# Altium project Fuel Cell Monitor Master.PrjPcb
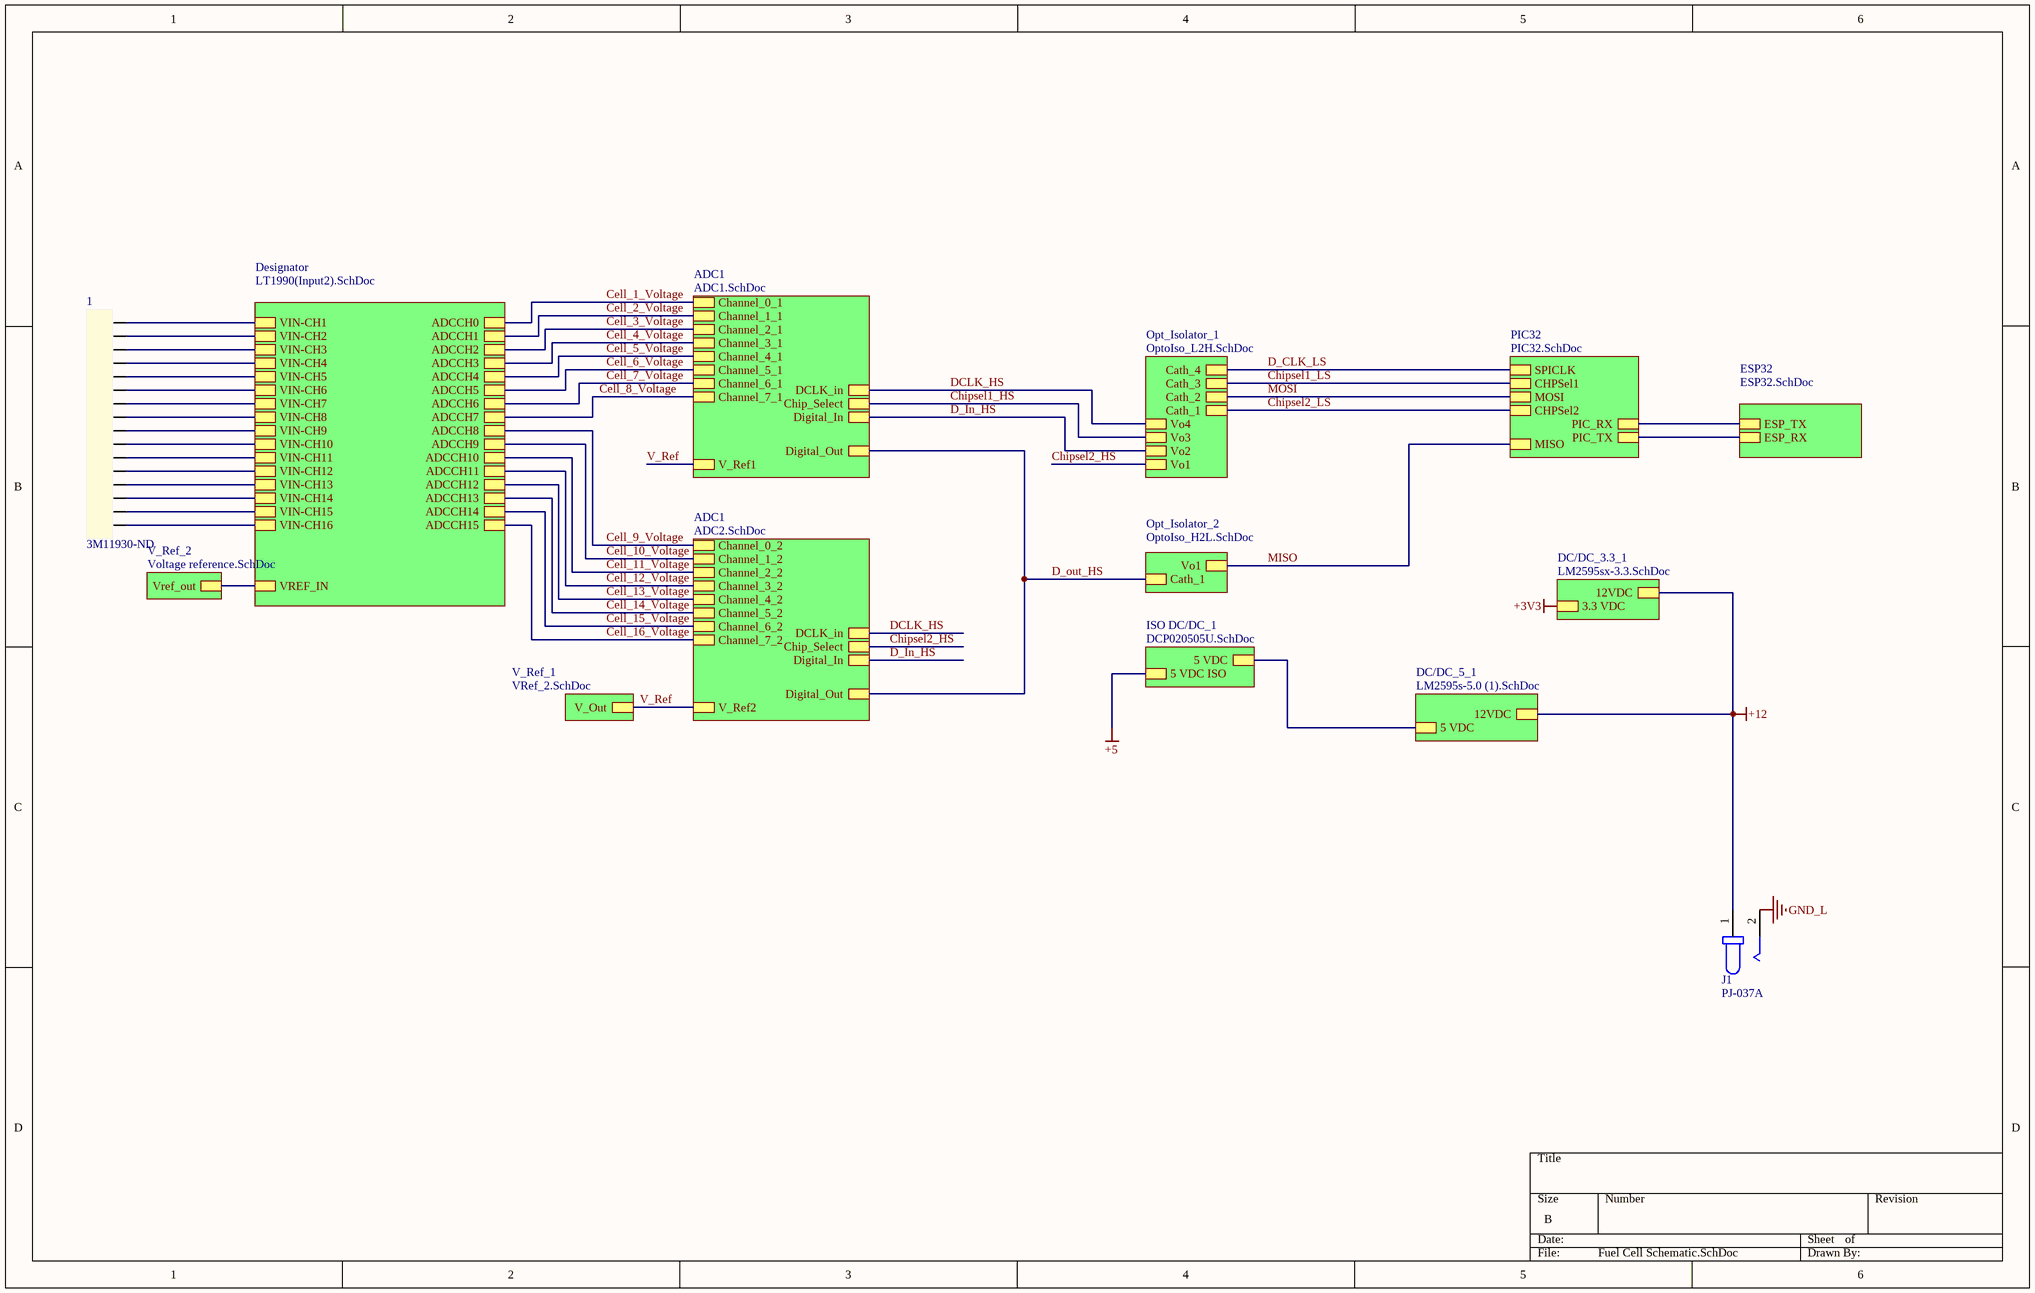
[diagram p0: Fuel Cell Schematic.SchDoc]
4 sheets, 24 parts. Net scope: hierarchical (ports join the sheet entries above them; power ports are global).
Board file: FCM_Integrated.PcbDoc
Sheets:
  Fuel Cell Schematic.SchDoc
    Opt_Isolator_1 = OptoIso_L2H.SchDoc
    ADC1 = ADC2.SchDoc
    PIC32 = PIC32.SchDoc

## Sheet Fuel Cell Schematic.SchDoc
size B; SheetNumber: 1; SheetTotal: 13

### Parts
1  Supplier Part Number 1: 3M11930-ND  [IDC Connector_16POS_2Layer]
J1  PJ-037A  [CUI_PJ-037A]

### Sub-sheets
ADC1 = ADC1.SchDoc (file not in this document): DCLK_in, Chip_Select, Digital_In, Digital_Out, Channel_0_1, Channel_1_1, Channel_2_1, Channel_3_1, Channel_4_1, Channel_5_1, Channel_6_1, Channel_7_1, V_Ref1
ADC1 = ADC2.SchDoc: DCLK_in, Chip_Select, Digital_In, Digital_Out, Channel_0_2, Channel_1_2, Channel_2_2, Channel_3_2, Channel_4_2, Channel_5_2, Channel_6_2, Channel_7_2, V_Ref2
DC/DC_3.3_1 = LM2595sx-3.3.SchDoc (file not in this document): 12VDC, 3.3 VDC
DC/DC_5_1 = LM2595s-5.0 (1).SchDoc (file not in this document): 12VDC, 5 VDC
Designator = LT1990(Input2).SchDoc (file not in this document): ADCCH1, ADCCH2, ADCCH3, VIN-CH3, ADCCH4, VIN-CH4, VIN-CH5, ADCCH5, VIN-CH6, ADCCH6, ADCCH7, ADCCH8, VIN-CH8, ADCCH9, VIN-CH9, ADCCH10, VIN-CH10, ADCCH11, VIN-CH11, ADCCH12, VIN-CH12, ADCCH13, VIN-CH13, ADCCH14, VIN-CH14, ADCCH15, VIN-CH15, VIN-CH16, VIN-CH2, ADCCH0, VIN-CH1, VREF_IN, VIN-CH7
ESP32 = ESP32.SchDoc (file not in this document): ESP_TX, ESP_RX
ISO DC/DC_1 = DCP020505U.SchDoc (file not in this document): 5 VDC, 5 VDC ISO
Opt_Isolator_1 = OptoIso_L2H.SchDoc: Vo4, Vo3, Vo2, Cath_4, Cath_3, Cath_2, Cath_1, Vo1
Opt_Isolator_2 = OptoIso_H2L.SchDoc (file not in this document): Cath_1, Vo1
PIC32 = PIC32.SchDoc: CHPSel2, MOSI, CHPSel1, PIC_TX, PIC_RX, MISO, SPICLK
V_Ref_1 = VRef_2.SchDoc (file not in this document): V_Out
V_Ref_2 = Voltage reference.SchDoc (file not in this document): Vref_out

### Nets
+12: J1.1 ; sheet DC/DC_3.3_1/12VDC, sheet DC/DC_5_1/12VDC
GND_L: J1.2
Cell_1_Voltage: sheet ADC1/Channel_0_1, sheet Designator/ADCCH0
Cell_2_Voltage: sheet ADC1/Channel_1_1, sheet Designator/ADCCH1
Cell_3_Voltage: sheet ADC1/Channel_2_1, sheet Designator/ADCCH2
Cell_4_Voltage: sheet ADC1/Channel_3_1, sheet Designator/ADCCH3
Cell_5_Voltage: sheet ADC1/Channel_4_1, sheet Designator/ADCCH4
Cell_6_Voltage: sheet ADC1/Channel_5_1, sheet Designator/ADCCH5
Cell_7_Voltage: sheet ADC1/Channel_6_1, sheet Designator/ADCCH6
Cell_8_Voltage: sheet ADC1/Channel_7_1, sheet Designator/ADCCH7
Cell_9_Voltage: sheet ADC1/Channel_0_2, sheet Designator/ADCCH8
Cell_10_Voltage: sheet ADC1/Channel_1_2, sheet Designator/ADCCH9
Cell_11_Voltage: sheet ADC1/Channel_2_2, sheet Designator/ADCCH10
Cell_12_Voltage: sheet ADC1/Channel_3_2, sheet Designator/ADCCH11
Cell_13_Voltage: sheet ADC1/Channel_4_2, sheet Designator/ADCCH12
Cell_14_Voltage: sheet ADC1/Channel_5_2, sheet Designator/ADCCH13
Cell_15_Voltage: sheet ADC1/Channel_6_2, sheet Designator/ADCCH14
Cell_16_Voltage: sheet ADC1/Channel_7_2, sheet Designator/ADCCH15
Chipsel1_HS: sheet ADC1/Chip_Select, sheet Opt_Isolator_1/Vo3
Chipsel1_LS: sheet Opt_Isolator_1/Cath_3, sheet PIC32/CHPSel1
Chipsel2_HS: sheet Opt_Isolator_1/Vo1, sheet ADC1/Chip_Select
Chipsel2_LS: sheet Opt_Isolator_1/Cath_1, sheet PIC32/CHPSel2
D_CLK_LS: sheet Opt_Isolator_1/Cath_4, sheet PIC32/SPICLK
D_In_HS: sheet ADC1/Digital_In, sheet Opt_Isolator_1/Vo2, sheet ADC1/Digital_In
D_out_HS: sheet ADC1/Digital_Out, sheet Opt_Isolator_2/Cath_1, sheet ADC1/Digital_Out
DCLK_HS: sheet ADC1/DCLK_in, sheet Opt_Isolator_1/Vo4, sheet ADC1/DCLK_in
ESPout-PICin: sheet ESP32/ESP_TX, sheet PIC32/PIC_RX
MISO: sheet Opt_Isolator_2/Vo1, sheet PIC32/MISO
MOSI: sheet Opt_Isolator_1/Cath_2, sheet PIC32/MOSI  [project net D_in_LS]
PICout-ESPin: sheet ESP32/ESP_RX, sheet PIC32/PIC_TX
V_Ref: sheet ADC1/V_Ref1, sheet ADC1/V_Ref2, sheet V_Ref_1/V_Out
Net1_1: 1.1 ; sheet Designator/VIN-CH1
Net1_2: 1.2 ; sheet Designator/VIN-CH2
Net1_3: 1.3 ; sheet Designator/VIN-CH3
Net1_4: 1.4 ; sheet Designator/VIN-CH4
Net1_5: 1.5 ; sheet Designator/VIN-CH5
Net1_6: 1.6 ; sheet Designator/VIN-CH6
Net1_7: 1.7 ; sheet Designator/VIN-CH7
Net1_8: 1.8 ; sheet Designator/VIN-CH8
Net1_9: 1.9 ; sheet Designator/VIN-CH9
Net1_10: 1.10 ; sheet Designator/VIN-CH10
Net1_11: 1.11 ; sheet Designator/VIN-CH11
Net1_12: 1.12 ; sheet Designator/VIN-CH12
Net1_13: 1.13 ; sheet Designator/VIN-CH13
Net1_14: 1.14 ; sheet Designator/VIN-CH14
Net1_15: 1.15 ; sheet Designator/VIN-CH15
Net1_16: 1.16 ; sheet Designator/VIN-CH16
(unnamed): sheet Designator/VREF_IN, sheet V_Ref_2/Vref_out
(unnamed): sheet ISO DC/DC_1/5 VDC, sheet DC/DC_5_1/5 VDC

### Library data of the parts
1 = 30316-5002HB: Conn Shrouded Header (4 Sides) HDR 16 POS 2.54mm Solder RA Side Entry Thru-Hole Box; Manufacturer: 3M; Gender: Male; Current Rating: 1A; Number of Positions: 16; Connector Type: Male Pin; Row Spacing: 0.1inch; Supplier 1: Digi-Key; Manufacturer Part Number: 30316-5002HB; RoHS: Yes; Category: Connectors; Stock 1: 5922; Pricing 1: 1=1.55000, 10=1.35200, 100=1.20850, 500=1.00712, 1000=0.86325, 5000=0.76541, 10000=0.74815 (USD); Mounting Technology: Through Hole; Contact Plating: Gold; Contact Material: Brass; Color: Black; Housing Material: Polyester; Housing Color: Black; Min Operating Temperature: -55°C; Max Operating Temperature: 105°C; Number of Rows: 2; Termination: Solder; Package Quantity: 1000; Packaging: Bulk; Series: 303; Contact Type: Male Pin; Orientation: Right Angle; Max Current Rating: 1A; Length: 27.9mm; Pitch: 2.54mm; Contact Mating Length: 0.236inch; Depth: 13.26mm; Lead Free: Lead Free; RoHS Compliant: Yes; ComponentLink1URL: https://datasheet.ciiva.com/6832/ts0818-6832733.pdf?src-supplier=Digi-Key; ComponentLink1Description: https://datasheet.ciiva.com/6832/ts0818-6832733.pdf?src-supplier=Digi-Key
J1 = PJ-037A: 2.0 mm Center Pin, 2.5 A, Right Angle, Through Hole, Dc Power Jack Connector; Value: *; Price: None; MP: PJ-037A; Availability: Unavailable; Package: None

## Sheet OptoIso_L2H.SchDoc
size A; SheetNumber: 7; SheetTotal: 11
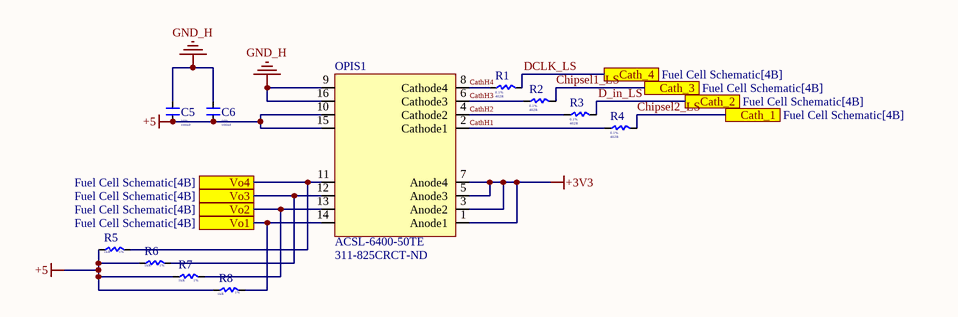
[diagram p1: OptoIso_L2H.SchDoc]

### Parts
C5  Tolerance: 10%  Capacitance: 100nF  [Capacitor_Kemet_0805]
C6  Tolerance: 10%  Capacitance: 100nF  [Capacitor_Kemet_0805]
OPIS1  Supplier Part Number 2: 311-825CRCT-ND  [Opto_Isolator_ACSL6400_50TE]
R1  Tolerance: 0.1%  Resistance: 402R  [LowR_Yageo]
R2  Tolerance: 0.1%  Resistance: 402R  [LowR_Yageo]
R3  Tolerance: 0.1%  Resistance: 402R  [LowR_Yageo]
R4  Tolerance: 0.1%  Resistance: 402R  [LowR_Yageo]
R5  Resistance: 1kR  Tolerance: 1%  [Resistor_YAGEO_0805]
R6  Resistance: 1kR  Tolerance: 1%  [Resistor_YAGEO_0805]
R7  Resistance: 1kR  Tolerance: 1%  [Resistor_YAGEO_0805]
R8  Resistance: 1kR  Tolerance: 1%  [Resistor_YAGEO_0805]

### Ports
Cath_1 (see Fuel Cell Schematic[4B]), Cath_2 (see Fuel Cell Schematic[4B]), Cath_3 (see Fuel Cell Schematic[4B]), Cath_4 (see Fuel Cell Schematic[4B]), Vo1 (see Fuel Cell Schematic[4B]), Vo2 (see Fuel Cell Schematic[4B]), Vo3 (see Fuel Cell Schematic[4B]), Vo4 (see Fuel Cell Schematic[4B])

### Nets
+3V3: OPIS1.1(Anode1) OPIS1.3(Anode2) OPIS1.5(Anode3) OPIS1.7(Anode4)
+5: C5.2 C6.2 OPIS1.10(VDD) OPIS1.15(VDD) R5.1 R6.1 R7.1 R8.1
GND_H: C5.1 C6.1 OPIS1.9(Ground) OPIS1.16(Ground)
CathH1: OPIS1.2(Cathode1) R4.1
CathH2: OPIS1.4(Cathode2) R3.1
CathH3: OPIS1.6(Cathode3) R2.1
CathH4: OPIS1.8(Cathode4) R1.1
Chipsel1_HS: OPIS1.12(Vo3) R6.2 ; port Vo3
Chipsel1_LS: R2.2 ; port Cath_3
Chipsel2_HS: OPIS1.14(Vo1) R8.2 ; port Vo1
Chipsel2_LS: R4.2 ; port Cath_1
D_In_HS: OPIS1.13(Vo2) R7.2 ; port Vo2
D_in_LS: R3.2 ; port Cath_2
DCLK_HS: OPIS1.11(Vo4) R5.2 ; port Vo4
DCLK_LS: R1.2 ; port Cath_4  [project net D_CLK_LS]

### Library data of the parts
C5 C6 = C0805C104K6RACTU: Cap Ceramic 0.1uF 35V X7R 10% SMD 0805 125°C Paper T/R; Manufacturer: KEMET; Supplier 1: Digi-Key; Manufacturer Part Number: C0805C104K6RACTU; RoHS: Yes; Category: Ceramic Capacitors; Stock 1: 14662; Pricing 1: 1=0.44000, 10=0.30300, 50=0.21200, 100=0.18180, 500=0.13636, 1000=0.11514 (USD); Mount: Surface Mount; Case/Package: 0805; Dielectric Material: Ceramic; Min Operating Temperature: -55°C; Max Operating Temperature: 125°C; Packaging: Tape and Reel; Dielectric: X7R; Voltage Rating (DC): 35V; Construction: Flat; Length: 2mm; Height: 0.9mm; Depth: 1.25mm; Radiation Hardening: No; RoHS Compliant: Yes; ComponentLink1URL: http://www.kemet.com/kemet/web/homepage/kechome.nsf/weben/C4DA2DA1D1C9D3C3CA2570A50016092D/$file/KEM_C1002_X7R_SMD.pdf?src-supplier=Avnet; ComponentLink1Description: http://www.kemet.com/kemet/web/homepage/kechome.nsf/weben/C4DA2DA1D1C9D3C3CA2570A50016092D/$file/KEM_C1002_X7R_SMD.pdf?src-supplier=Avnet; ComponentLink2URL: https://api.kemet.com/component-edge/download/datasheet/C0805C104K6RAC7800.pdf?src-supplier=Digi-Key; ComponentLink2Description: https://api.kemet.com/component-edge/download/datasheet/C0805C104K6RAC7800.pdf?src-supplier=Digi-Key; Supplier Part Number 1: 399-17618-1-ND
OPIS1 = ACSL-6400-50TE: OPTOISO 2.5KV 4CH OPEN COLL 16SO; Manufacturer: Broadcom Avago; Forward Voltage: 1.8V; Forward Current: 15mA; Output Current: 50mA; Propagation Delay: 100ns; Reverse Breakdown Voltage: 5V; Max Power Dissipation: 40mW; Rise Time: 35ns; Number of Channels: 4; Fall Time: 12ns; Power Dissipation: 65mW; Data Rate: 15Mbps; Output Voltage: 7V; Input Type: DC; Supplier 1: Digi-Key; RoHS: Yes; Category: Optocouplers; Stock 1: 12687; Pricing 1: 1=10.50000, 10=7.61700, 100=6.29380, 500=5.51204 (USD); Mount: Surface Mount; Case/Package: SOIC; Number of Pins: 16; Contact Plating: Tin,Matte; Min Operating Temperature: -40°C; Max Operating Temperature: 100°C; Packaging: Tape and Reel; Max Output Current: 50mA; Package Quantity: 1000; Output Current per Channel: 50mA; Number of Elements: 4; Turn-On Delay Time: 100ns; Isolation Voltage: 2.5kV; Input Current: 15mA; Series: -; Radiation Hardening: No; REACH SVHC: No SVHC; Lead Free: Lead Free; RoHS Compliant: Yes; ComponentLink1URL: http://components.arrow.com/part/dataview/41316762S9676761N7786?src-supplier=Arrow+Electronics; ComponentLink1Description: http://components.arrow.com/part/dataview/41316762S9676761N7786?src-supplier=Arrow+Electronics; ComponentLink2URL: http://www.farnell.com/datasheets/1790955.pdf?src-supplier=Farnell; ComponentLink2Description: http://www.farnell.com/datasheets/1790955.pdf?src-supplier=Farnell; ComponentLink3URL: https://www.verical.com/server-webapp/html/getDatasheet?partID=300680&src-supplier=Verical; ComponentLink3Description: https://www.verical.com/server-webapp/html/getDatasheet?partID=300680&src-supplier=Verical; ComponentLink4URL: http://www.avagotech.com/docs/AV02-0235EN?src-supplier=Avnet; ComponentLink4Description: http://www.avagotech.com/docs/AV02-0235EN?src-supplier=Avnet; ComponentLink5URL: http://www.avagotech.com/docs/AV02-0235EN?src-supplier=Digi-Key; ComponentLink5Description: http://www.avagotech.com/docs/AV02-0235EN?src-supplier=Digi-Key; ComponentLink6URL: https://docs.broadcom.com/docs/AV02-0235EN?src-supplier=Digi-Key; ComponentLink6Description: https://docs.broadcom.com/docs/AV02-0235EN?src-supplier=Digi-Key; ComponentLink7URL: http://www.farnell.com/datasheets/1790955.pdf?src-supplier=Newark; ComponentLink7Description: http://www.farnell.com/datasheets/1790955.pdf?src-supplier=Newark; ComponentLink8URL: http://www.farnell.com/datasheets/1790955.pdf?src-supplier=Element14; ComponentLink8Description: http://www.farnell.com/datasheets/1790955.pdf?src-supplier=Element14; ComponentLink9URL: http://www.avagotech.com/search/results.jsp?src=&siteCriteria=ACSL6400&src-supplier=Mouser; ComponentLink9Description: http://www.avagotech.com/search/results.jsp?src=&siteCriteria=ACSL6400&src-supplier=Mouser; Supplier Part Number 1: 516-2917-1-ND; Supplier 2: Digi-Key; Manufacturer Part Number: ACSL-6400-50TE
R1-R4 = RT0805BRD07402RL: Res Thin Film 0805 402 Ohm 0.1% 1/8W ±25ppm/°C Molded SMD Paper T/R; Manufacturer: Yageo; Voltage Rating: 150V; Power Rating: 125mW; Supplier 1: Digi-Key; Manufacturer Part Number: RT0805BRD07402RL; RoHS: Yes; Category: Chip SMD Resistors; Stock 1: 13492; Pricing 1: 1=0.38000, 10=0.27200, 100=0.10870, 1000=0.05357, 2500=0.04963 (USD); Case/Package: 0805; Case Code (Metric): 2012; Case Code (Imperial): 0805; Min Operating Temperature: -55°C; Max Operating Temperature: 125°C; Packaging: Tape and Reel; Termination: SMD/SMT; Temperature Coefficient: 25ppm/°C; Voltage Rating (DC): 150V; Series: RT; Length: 2mm; Width: 1.25mm; Height: 500um; Lead Free: Lead Free; RoHS Compliant: Yes; ComponentLink1URL: https://datasheet.ciiva.com/12706/pyu-rt-1-to-0-05-rohs-l-4-12706505.pdf?src-supplier=Mouser; ComponentLink1Description: https://datasheet.ciiva.com/12706/pyu-rt-1-to-0-05-rohs-l-4-12706505.pdf?src-supplier=Mouser; Supplier Part Number 1: YAG4897CT-ND
R5-R8 = RC0805FR-071KP: Res Thick Film 0805 1K Ohm 1% 0.125W(1/8W) ±100ppm/C Pad SMD T/R; Manufacturer: Yageo; Max Power Dissipation: 125mW; Temperature Coefficient: 100ppm/°C; Supplier 1: Digi-Key; Manufacturer Part Number: RC0805FR-071KP; RoHS: Yes; Category: Chip SMD Resistors; Stock 1: 37560; Pricing 1: 1=0.10000, 10=0.06400, 100=0.02600, 1000=0.01168, 2500=0.01014 (USD); Case/Package: 0805; Case Code (Metric): 2012; Case Code (Imperial): 0805; Min Operating Temperature: -55°C; Max Operating Temperature: 155°C; Packaging: Tape and Reel; Resistor Type: Thick Film; Number of Terminations: 2; Features: Moisture Resistant; Length: 0.079inch; Width: 0.049inch; Height: 0.024inch; RoHS Compliant: Yes; ComponentLink1URL: http://www.yageo.com/NewPortal/yageodocoutput?fileName=/pdf/R-Chip/PYu-RC_51_RoHS_P_0.pdf&src-supplier=Digi-Key; ComponentLink1Description: http://www.yageo.com/NewPortal/yageodocoutput?fileName=/pdf/R-Chip/PYu-RC_51_RoHS_P_0.pdf&src-supplier=Digi-Key; ComponentLink2URL: http://www.yageo.com.tw/exep/pages/download/literatures/PYu-R_INT-thick_7.pdf?src-supplier=Digi-Key; ComponentLink2Description: http://www.yageo.com.tw/exep/pages/download/literatures/PYu-R_INT-thick_7.pdf?src-supplier=Digi-Key; Supplier Part Number 1: YAG1321CT-ND

## Sheet ADC2.SchDoc
size A; SheetNumber: 11; SheetTotal: 11
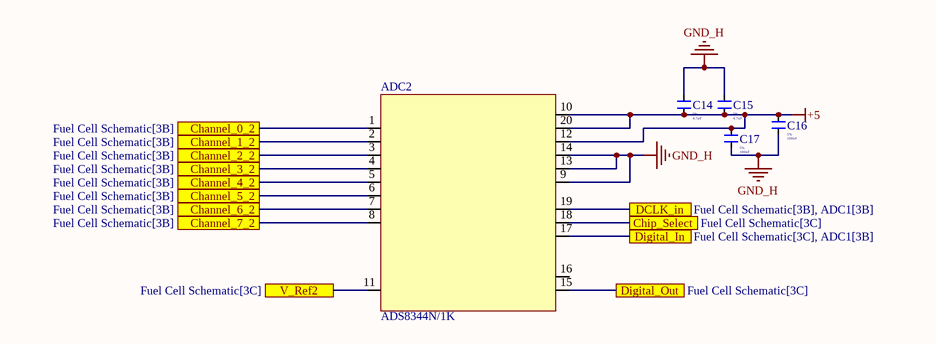
[diagram p2: ADC2.SchDoc]

### Parts
ADC2  ADS8344N/1K  [ADS8344]
C14  Tolerance: 5%  Capacitance: 4.7uF  [Capacitor_Kemet_0805]
C15  Tolerance: 5%  Capacitance: 4.7uF  [Capacitor_Kemet_0805]
C16  Dissipation Factor: 5%  Capacitance: 100nF  [Capacitor_Kemet_0805]
C17  Dissipation Factor: 5%  Capacitance: 100nF  [Capacitor_Kemet_0805]

### Ports
Channel_0_2 (see Fuel Cell Schematic[3B]), Channel_1_2 (see Fuel Cell Schematic[3B]), Channel_2_2 (see Fuel Cell Schematic[3B]), Channel_3_2 (see Fuel Cell Schematic[3B]), Channel_4_2 (see Fuel Cell Schematic[3B]), Channel_5_2 (see Fuel Cell Schematic[3B]), Channel_6_2 (see Fuel Cell Schematic[3B]), Channel_7_2 (see Fuel Cell Schematic[3B]), Chip_Select (see Fuel Cell Schematic[3C]), DCLK_in (see Fuel Cell Schematic[3B], ADC1[3B]), Digital_In (see Fuel Cell Schematic[3C], ADC1[3B]), Digital_Out (see Fuel Cell Schematic[3C]), V_Ref2 (see Fuel Cell Schematic[3C])

### Nets
+5: ADC2.10(Shutdown) ADC2.12(+VCC) ADC2.20(+VCC) C14.1 C15.1 C16.2 C17.2
GND_H: ADC2.9(Common_Reference) ADC2.13(Ground) ADC2.14(Ground) C14.2 C15.2 C16.1 C17.1
Cell_9_Voltage: ADC2.1(Channel_0) ; port Channel_0_2
Cell_10_Voltage: ADC2.2(Channel_1) ; port Channel_1_2
Cell_11_Voltage: ADC2.3(Channel_2) ; port Channel_2_2
Cell_12_Voltage: ADC2.4(Channel_3) ; port Channel_3_2
Cell_13_Voltage: ADC2.5(Channel_4) ; port Channel_4_2
Cell_14_Voltage: ADC2.6(Channel_5) ; port Channel_5_2
Cell_15_Voltage: ADC2.7(Channel_6) ; port Channel_6_2
Cell_16_Voltage: ADC2.8(Channel_7) ; port Channel_7_2
Chipsel2_HS: ADC2.18(Chip_Select) ; port Chip_Select
D_In_HS: ADC2.17(Digital_In) ; port Digital_In
D_out_HS: ADC2.15(Digital_Out) ; port Digital_Out
DCLK_HS: ADC2.19(Digital_Clock) ; port DCLK_in
V_Ref: ADC2.11(V_Reference) ; port V_Ref2

Not connected (* = marked no-connect by the designer): ADC2 16(Busy)

### Library data of the parts
ADC2 = ADS8344N/1K: IC ADC 16BIT SAR 20SSOP; Manufacturer: Texas Instruments; Nominal Supply Current: 1.5mA; Min Supply Voltage: 2.7V; Max Supply Voltage: 5.25V; Max Power Dissipation: 10mW; Interface: Serial; Number of Bits: 16; Sampling Rate: 100KS/s; Number of Converters: 1; Resolution: 16b; Polarity: Unipolar; Number of Inputs: 8; Integral Nonlinearity (INL): 6LSB; Spurious-free dynamic range (SFDR): 92dB; Power Consumption: 3.6mW; Supply Type: Single; Differential Nonlinearity: 2LSB; Power Dissipation: 7.5mW; Operating Supply Voltage: 5V; Supplier 1: Digi-Key; Manufacturer Part Number: ADS8344N/1K; RoHS: Yes; Category: Analog to Digital Converters (ADCs); Stock 1: 1147; Pricing 1: 1=18.10000, 10=16.63400, 25=15.94480, 100=14.04870, 250=13.35924, 500=13.00960 (USD); Case/Package: SSOP; Number of Pins: 20; Contact Plating: Gold; Min Operating Temperature: -40°C; Max Operating Temperature: 85°C; Packaging: Tape and Reel; Package Quantity: 1000; Number of A/D Converters: 1; Conversion Rate: 100KS/s; Max Supply Voltage (DC): 5.25V; Min Supply Voltage (DC): 2.7V; Series: -; Supply Current: 1.5mA; REACH SVHC: No SVHC; Lead Free: Lead Free; RoHS Compliant: Yes; ComponentLink1URL: https://datasheet.ciiva.com/4031/2422049s9164356n7713-4031078.pdf?src-supplier=Arrow+Electronics; ComponentLink1Description: https://datasheet.ciiva.com/4031/2422049s9164356n7713-4031078.pdf?src-supplier=Arrow+Electronics; ComponentLink2URL: https://datasheet.ciiva.com/1308/ads8344-1308384.pdf?src-supplier=Digi-Key; ComponentLink2Description: https://datasheet.ciiva.com/1308/ads8344-1308384.pdf?src-supplier=Digi-Key; Supplier Part Number 1: 296-41197-1-ND
C14 C15 = C0805C475J4RACAUTO: CAP CER 4.7UF 16V X7R 0805; Manufacturer: KEMET; Supplier 1: Digi-Key; RoHS: Yes; Category: Ceramic Capacitors; Stock 1: 16673; Pricing 1: 1=0.56000, 10=0.39300, 50=0.29680, 100=0.25850, 500=0.19150, 1000=0.16277 (USD); Mount: Surface Mount; Case/Package: 0805; Min Operating Temperature: -55°C; Max Operating Temperature: 125°C; Packaging: Tape and Reel; Voltage Rating: 16V; Ratings: AEC-Q200; RoHS Compliant: Yes; ComponentLink1URL: http://www.farnell.com/datasheets/2741387.pdf?src-supplier=Farnell; ComponentLink1Description: http://www.farnell.com/datasheets/2741387.pdf?src-supplier=Farnell; ComponentLink2URL: https://api.kemet.com/component-edge/download/datasheet/C0805C475J4RACAUTO.pdf?src-supplier=Digi-Key; ComponentLink2Description: https://api.kemet.com/component-edge/download/datasheet/C0805C475J4RACAUTO.pdf?src-supplier=Digi-Key; ComponentLink3URL: http://www.farnell.com/datasheets/2741387.pdf?src-supplier=Newark; ComponentLink3Description: http://www.farnell.com/datasheets/2741387.pdf?src-supplier=Newark; Supplier Part Number 1: 399-15716-1-ND; Manufacturer Part Number: C0805C475J4RACAUTO
C16 C17 = C0805C104J4RACTU: Cap Ceramic 0.1uF 16V X7R 5% SMD 0805 125°C Plastic T/R; Manufacturer: KEMET; Supplier 1: Digi-Key; Manufacturer Part Number: C0805C104J4RACTU; RoHS: Yes; Category: Ceramic Capacitors; Stock 1: 21669; Pricing 1: 1=0.53000, 10=0.37300, 50=0.28180, 100=0.24540, 500=0.18180, 1000=0.15453 (USD); Mount: Surface Mount; Case/Package: 0805; Case Code (Imperial): 0805; Case Code (Metric): 2012; Dielectric Material: Ceramic; Min Operating Temperature: -55°C; Max Operating Temperature: 125°C; Package Quantity: 4000; Packaging: Tape and Reel; Voltage Rating: 16V; Voltage Rating (DC): 16V; Dielectric: X7R; Termination: SMD/SMT; Series: -; Length: 2mm; Width: 1.2mm; Height: 0.9mm; Lead Pitch: 0.75mm; Thickness: 0.035inch; Depth: 1.25mm; RoHS Compliant: Yes; ComponentLink1URL: http://www.farnell.com/datasheets/2746326.pdf?src-supplier=Farnell; ComponentLink1Description: http://www.farnell.com/datasheets/2746326.pdf?src-supplier=Farnell; ComponentLink2URL: http://www.farnell.com/datasheets/2323359.pdf?src-supplier=Farnell; ComponentLink2Description: http://www.farnell.com/datasheets/2323359.pdf?src-supplier=Farnell; ComponentLink3URL: http://www.mouser.com/ds/2/212/KEM_C1002_X7R_SMD-1102033.pdf?src-supplier=Mouser; ComponentLink3Description: http://www.mouser.com/ds/2/212/KEM_C1002_X7R_SMD-1102033.pdf?src-supplier=Mouser; ComponentLink4URL: http://components.arrow.com/part/dataview/3452184S4481915N7429?src-supplier=Arrow+Electronics; ComponentLink4Description: http://components.arrow.com/part/dataview/3452184S4481915N7429?src-supplier=Arrow+Electronics; ComponentLink5URL: https://api.kemet.com/component-edge/download/datasheet/C0805C104J4RACTU.pdf?src-supplier=Digi-Key; ComponentLink5Description: https://api.kemet.com/component-edge/download/datasheet/C0805C104J4RACTU.pdf?src-supplier=Digi-Key; ComponentLink6URL: http://www.farnell.com/datasheets/2330568.pdf?src-supplier=Newark; ComponentLink6Description: http://www.farnell.com/datasheets/2330568.pdf?src-supplier=Newark; ComponentLink7URL: http://www.farnell.com/datasheets/2746326.pdf?src-supplier=Newark; ComponentLink7Description: http://www.farnell.com/datasheets/2746326.pdf?src-supplier=Newark; Supplier Part Number 1: 399-C0805C104J4RAC7800CT-ND

## Sheet PIC32.SchDoc
size A; SheetNumber: 13; SheetTotal: 13
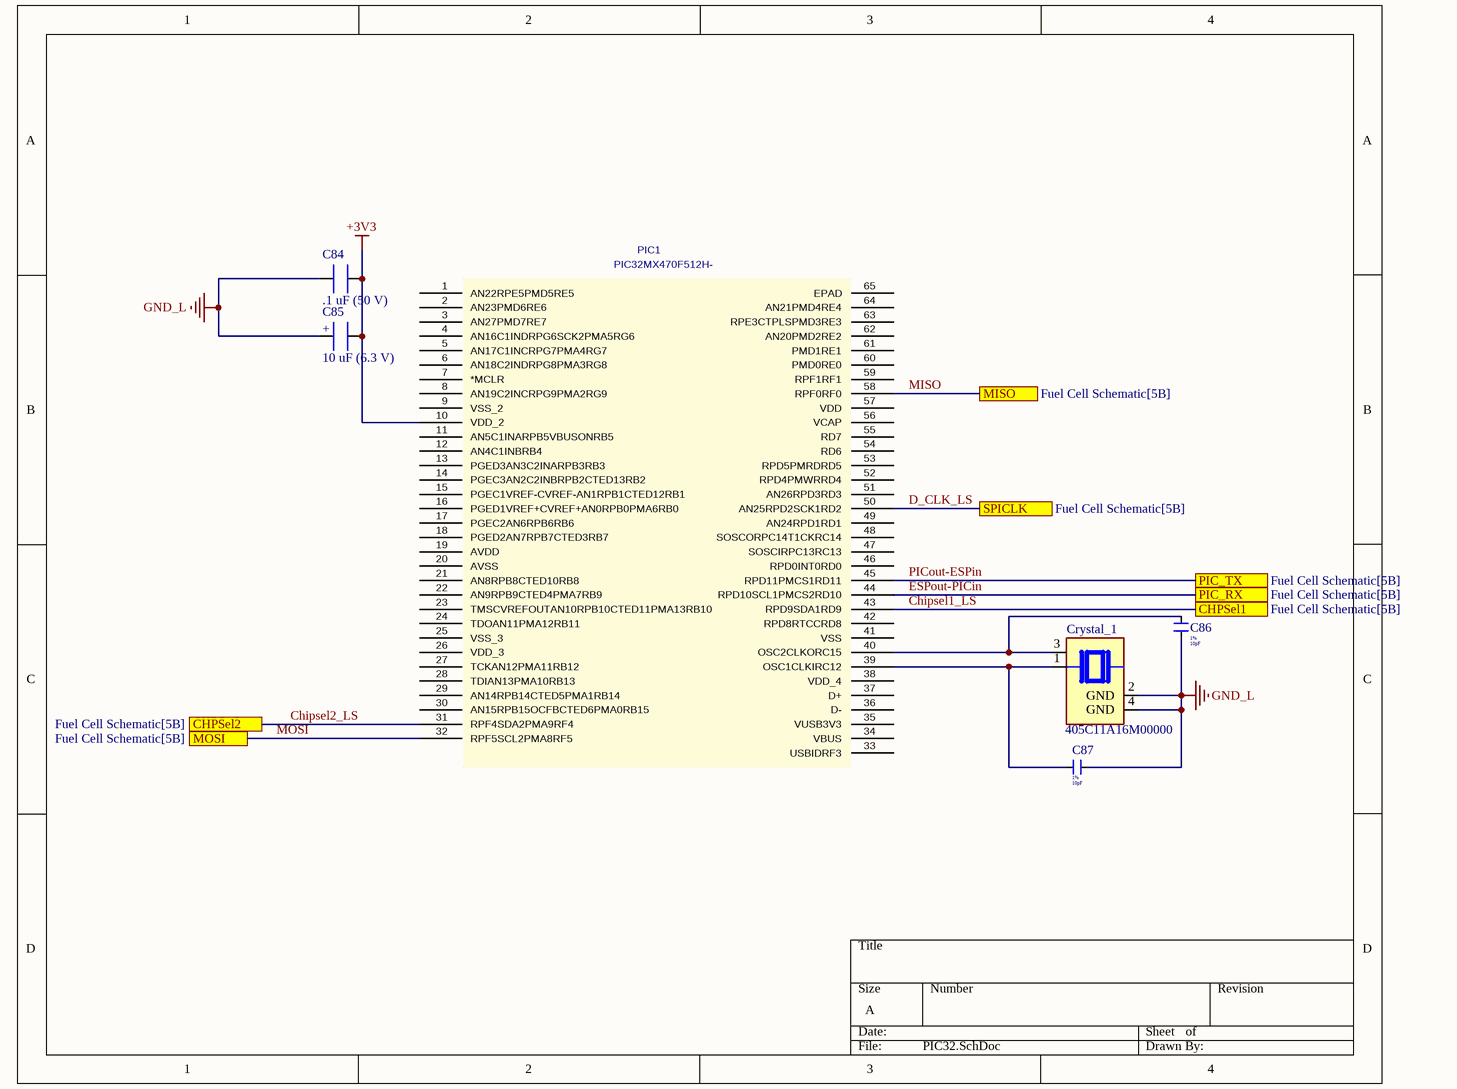
[diagram p3: PIC32.SchDoc]

### Parts
C84  .1 uF (50 V)  [.1uF capacitor]
C85  10 uF (6.3 V)  [10 uF cap]
C86  Tollerance: 1%  Capacitance: 10pF  [Kemet_10pF_0805]
C87  Tollerance: 1%  Capacitance: 10pF  [Kemet_10pF_0805]
Crystal_1  405C11A16M00000  [XTAL_405C11A16M00000]
PIC1  PIC32MX470F512H-  [Quad64]

### Ports
CHPSel1 (see Fuel Cell Schematic[5B]), CHPSel2 (see Fuel Cell Schematic[5B]), MISO (see Fuel Cell Schematic[5B]), MOSI (see Fuel Cell Schematic[5B]), PIC_RX (see Fuel Cell Schematic[5B]), PIC_TX (see Fuel Cell Schematic[5B]), SPICLK (see Fuel Cell Schematic[5B])

### Nets
+3V3: C84.2 C85.2 PIC1.10(VDD_2)
GND_L: C84.1 C85.1 C86.2 C87.1 Crystal_1.2(GND) Crystal_1.4(GND)
Chipsel1_LS: PIC1.43(RPD9SDA1RD9) ; port CHPSel1
Chipsel2_LS: PIC1.31(RPF4SDA2PMA9RF4) ; port CHPSel2
D_CLK_LS: PIC1.50(AN25RPD2SCK1RD2) ; port SPICLK
ESPout-PICin: PIC1.44(RPD10SCL1PMCS2RD10) ; port PIC_RX
MISO: PIC1.58(RPF0RF0) ; port MISO
MOSI: PIC1.32(RPF5SCL2PMA8RF5) ; port MOSI  [project net D_in_LS]
PICout-ESPin: PIC1.45(RPD11PMCS1RD11) ; port PIC_TX
NetC86_1: C86.1 Crystal_1.3 PIC1.40(OSC2CLKORC15)
NetC87_2: C87.2 Crystal_1.1 PIC1.39(OSC1CLKIRC12)

Not connected (* = marked no-connect by the designer): PIC1 1(AN22RPE5PMD5RE5) 2(AN23PMD6RE6) 3(AN27PMD7RE7) 4(AN16C1INDRPG6SCK2PMA5RG6) 5(AN17C1INCRPG7PMA4RG7) 6(AN18C2INDRPG8PMA3RG8) 7(*MCLR) 8(AN19C2INCRPG9PMA2RG9) 9(VSS_2) 11(AN5C1INARPB5VBUSONRB5) 12(AN4C1INBRB4) 13(PGED3AN3C2INARPB3RB3) 14(PGEC3AN2C2INBRPB2CTED13RB2) 15(PGEC1VREF-CVREF-AN1RPB1CTED12RB1) 16(PGED1VREF+CVREF+AN0RPB0PMA6RB0) 17(PGEC2AN6RPB6RB6) 18(PGED2AN7RPB7CTED3RB7) 19(AVDD) 20(AVSS) 21(AN8RPB8CTED10RB8) 22(AN9RPB9CTED4PMA7RB9) 23(TMSCVREFOUTAN10RPB10CTED11PMA13RB10) 24(TDOAN11PMA12RB11) 25(VSS_3) 26(VDD_3) 27(TCKAN12PMA11RB12) 28(TDIAN13PMA10RB13) 29(AN14RPB14CTED5PMA1RB14) 30(AN15RPB15OCFBCTED6PMA0RB15) 33(USBIDRF3) 34(VBUS) 35(VUSB3V3) 36(D-) 37(D+) 38(VDD_4) 41(VSS) 42(RPD8RTCCRD8) 46(RPD0INT0RD0) 47(SOSCIRPC13RC13) 48(SOSCORPC14T1CKRC14) 49(AN24RPD1RD1) 51(AN26RPD3RD3) 52(RPD4PMWRRD4) 53(RPD5PMRDRD5) 54(RD6) 55(RD7) 56(VCAP) 57(VDD) 59(RPF1RF1) 60(PMD0RE0) 61(PMD1RE1) 62(AN20PMD2RE2) 63(RPE3CTPLSPMD3RE3) 64(AN21PMD4RE4) 65(EPAD)

### Notes on the sheet
- (in symbol 10 uF cap) +

### Library data of the parts
C84 = .1 uF cap
C85 = 10 uF cap
C86 C87 = C0805C100F5GACAUTO: Cap, AEC-Q200, 10PF, 50V, Mlcc, 0805;; Manufacturer: KEMET; Supplier 1: Digi-Key; RoHS: Yes; Category: Ceramic Capacitors; Stock 1: 3879; Pricing 1: 1=0.74000, 10=0.54800, 50=0.43840, 100=0.37570, 500=0.29744, 1000=0.25048 (USD); RoHS Compliant: Yes; Supplier Part Number 1: 399-C0805C100F5GACAUTOCT-ND; Manufacturer Part Number: C0805C100F5GACAUTO
Crystal_1 = 405C11A16M00000: CRYSTAL 16.0000MHZ 10PF SMD; MF: CTS-Frequency Controls; Digi-Key_Part_Number: CTX834TR-ND; Check_prices: https://www.snapeda.com/parts/405C11A16M00000/CTS-Frequency+Controls/view-part/?ref=eda; Purchase-URL: https://pricing.snapeda.com/search/part/405C11A16M00000/?ref=eda; Package: NON STANDARD-4 CTS Components; MP: 405C11A16M00000; Value: *; SnapEDA_Link: https://www.snapeda.com/parts/405C11A16M00000/CTS-Frequency+Controls/view-part/?ref=snap
PIC1 = PIC32MX470F512H-: Mfr_Name: Microchip; Manufacturer_Part_Number: PIC32MX470F512H-I/MR; C: Copyright (C) 2018 Accelerated Designs. All rights reserved; Value: PIC32MX470F512H-; Copyright: Copyright (C) 2023 Ultra Librarian. All rights reserved.

## Nets that join several sheets
+3V3: OptoIso_L2H (OPIS1.1 OPIS1.3 OPIS1.5 OPIS1.7), PIC32 (C84.2 C85.2 PIC1.10)
+5: OptoIso_L2H (8 pins), ADC2 (7 pins)
GND_H: OptoIso_L2H (C5.1 C6.1 OPIS1.9 OPIS1.16), ADC2 (7 pins)
GND_L: Fuel Cell Schematic (J1.2), PIC32 (6 pins)
Chipsel1_LS: OptoIso_L2H (R2.2), PIC32 (PIC1.43)
Chipsel2_HS: OptoIso_L2H (OPIS1.14 R8.2), ADC2 (ADC2.18)
Chipsel2_LS: OptoIso_L2H (R4.2), PIC32 (PIC1.31)
D_CLK_LS: OptoIso_L2H (R1.2), PIC32 (PIC1.50)
D_In_HS: OptoIso_L2H (OPIS1.13 R7.2), ADC2 (ADC2.17)
D_in_LS: OptoIso_L2H (R3.2), PIC32 (PIC1.32)
DCLK_HS: OptoIso_L2H (OPIS1.11 R5.2), ADC2 (ADC2.19)